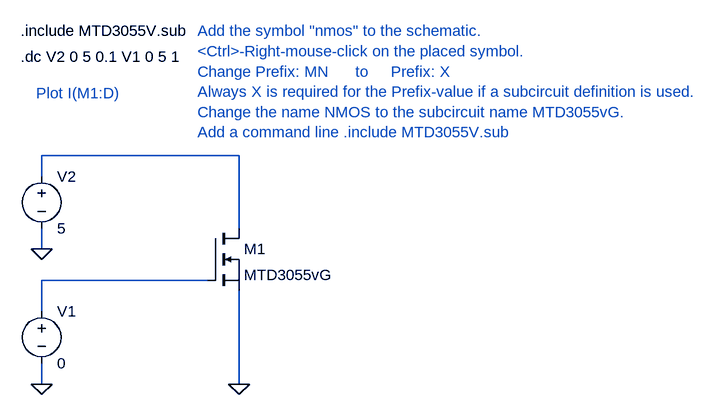
[diagram p0: schematic MTD3055V_test.asc]
MTD3055V_test.asc, the LTspice schematic file:
Version 4
SHEET 1 1036 680
WIRE -96 128 -96 96
WIRE -96 240 -96 208
WIRE -96 336 -96 288
WIRE -96 448 -96 416
WIRE 160 288 -96 288
WIRE 208 96 -96 96
WIRE 208 208 208 96
WIRE 208 448 208 304
FLAG 208 448 0
FLAG -96 448 0
FLAG -96 240 0
SYMBOL nmos 160 208 R0
SYMATTR InstName M1
SYMATTR Value MTD3055vG
SYMATTR Prefix X
SYMBOL voltage -96 320 R0
SYMATTR InstName V1
SYMATTR Value 0
SYMBOL voltage -96 112 R0
SYMATTR InstName V2
SYMATTR Value 5
TEXT -128 -96 Left 0 !.include MTD3055V.sub
TEXT -128 -56 Left 0 !.dc V2 0 5 0.1 V1 0 5 1
TEXT 144 -96 Left 0 ;Add the symbol "nmos" to the schematic.\n<Ctrl>-Right-mouse-click on the placed symbol.\nChange Prefix: MN      to     Prefix: X\nAlways X is required for the Prefix-value if a subcircuit definition is used.\nChange the name NMOS to the subcircuit name MTD3055vG.\nAdd a command line .include MTD3055V.sub
TEXT -104 0 Left 0 ;Plot I(M1:D)

The netlist it stands for:
* MTD3055V_test.asc
XM1 N001 N002 0 MTD3055vG  ; pins D G S
V1 N002 0 0
V2 N001 0 5
.include MTD3055V.sub
.dc V2 0 5 0.1 V1 0 5 1
* Add the symbol "nmos" to the schematic.
* <Ctrl>-Right-mouse-click on the placed symbol.
* Change Prefix: MN      to     Prefix: X
* Always X is required for the Prefix-value if a subcircuit definition is used.
* Change the name NMOS to the subcircuit name MTD3055vG.
* Add a command line .include MTD3055V.sub
* Plot I(M1:D)
.backanno
.end